# EasyEDA Pro project OLED_UI_WeatherClock.epro

# Schematic Schematic1
Board Name: Board1; Create Date: 2025-10-31
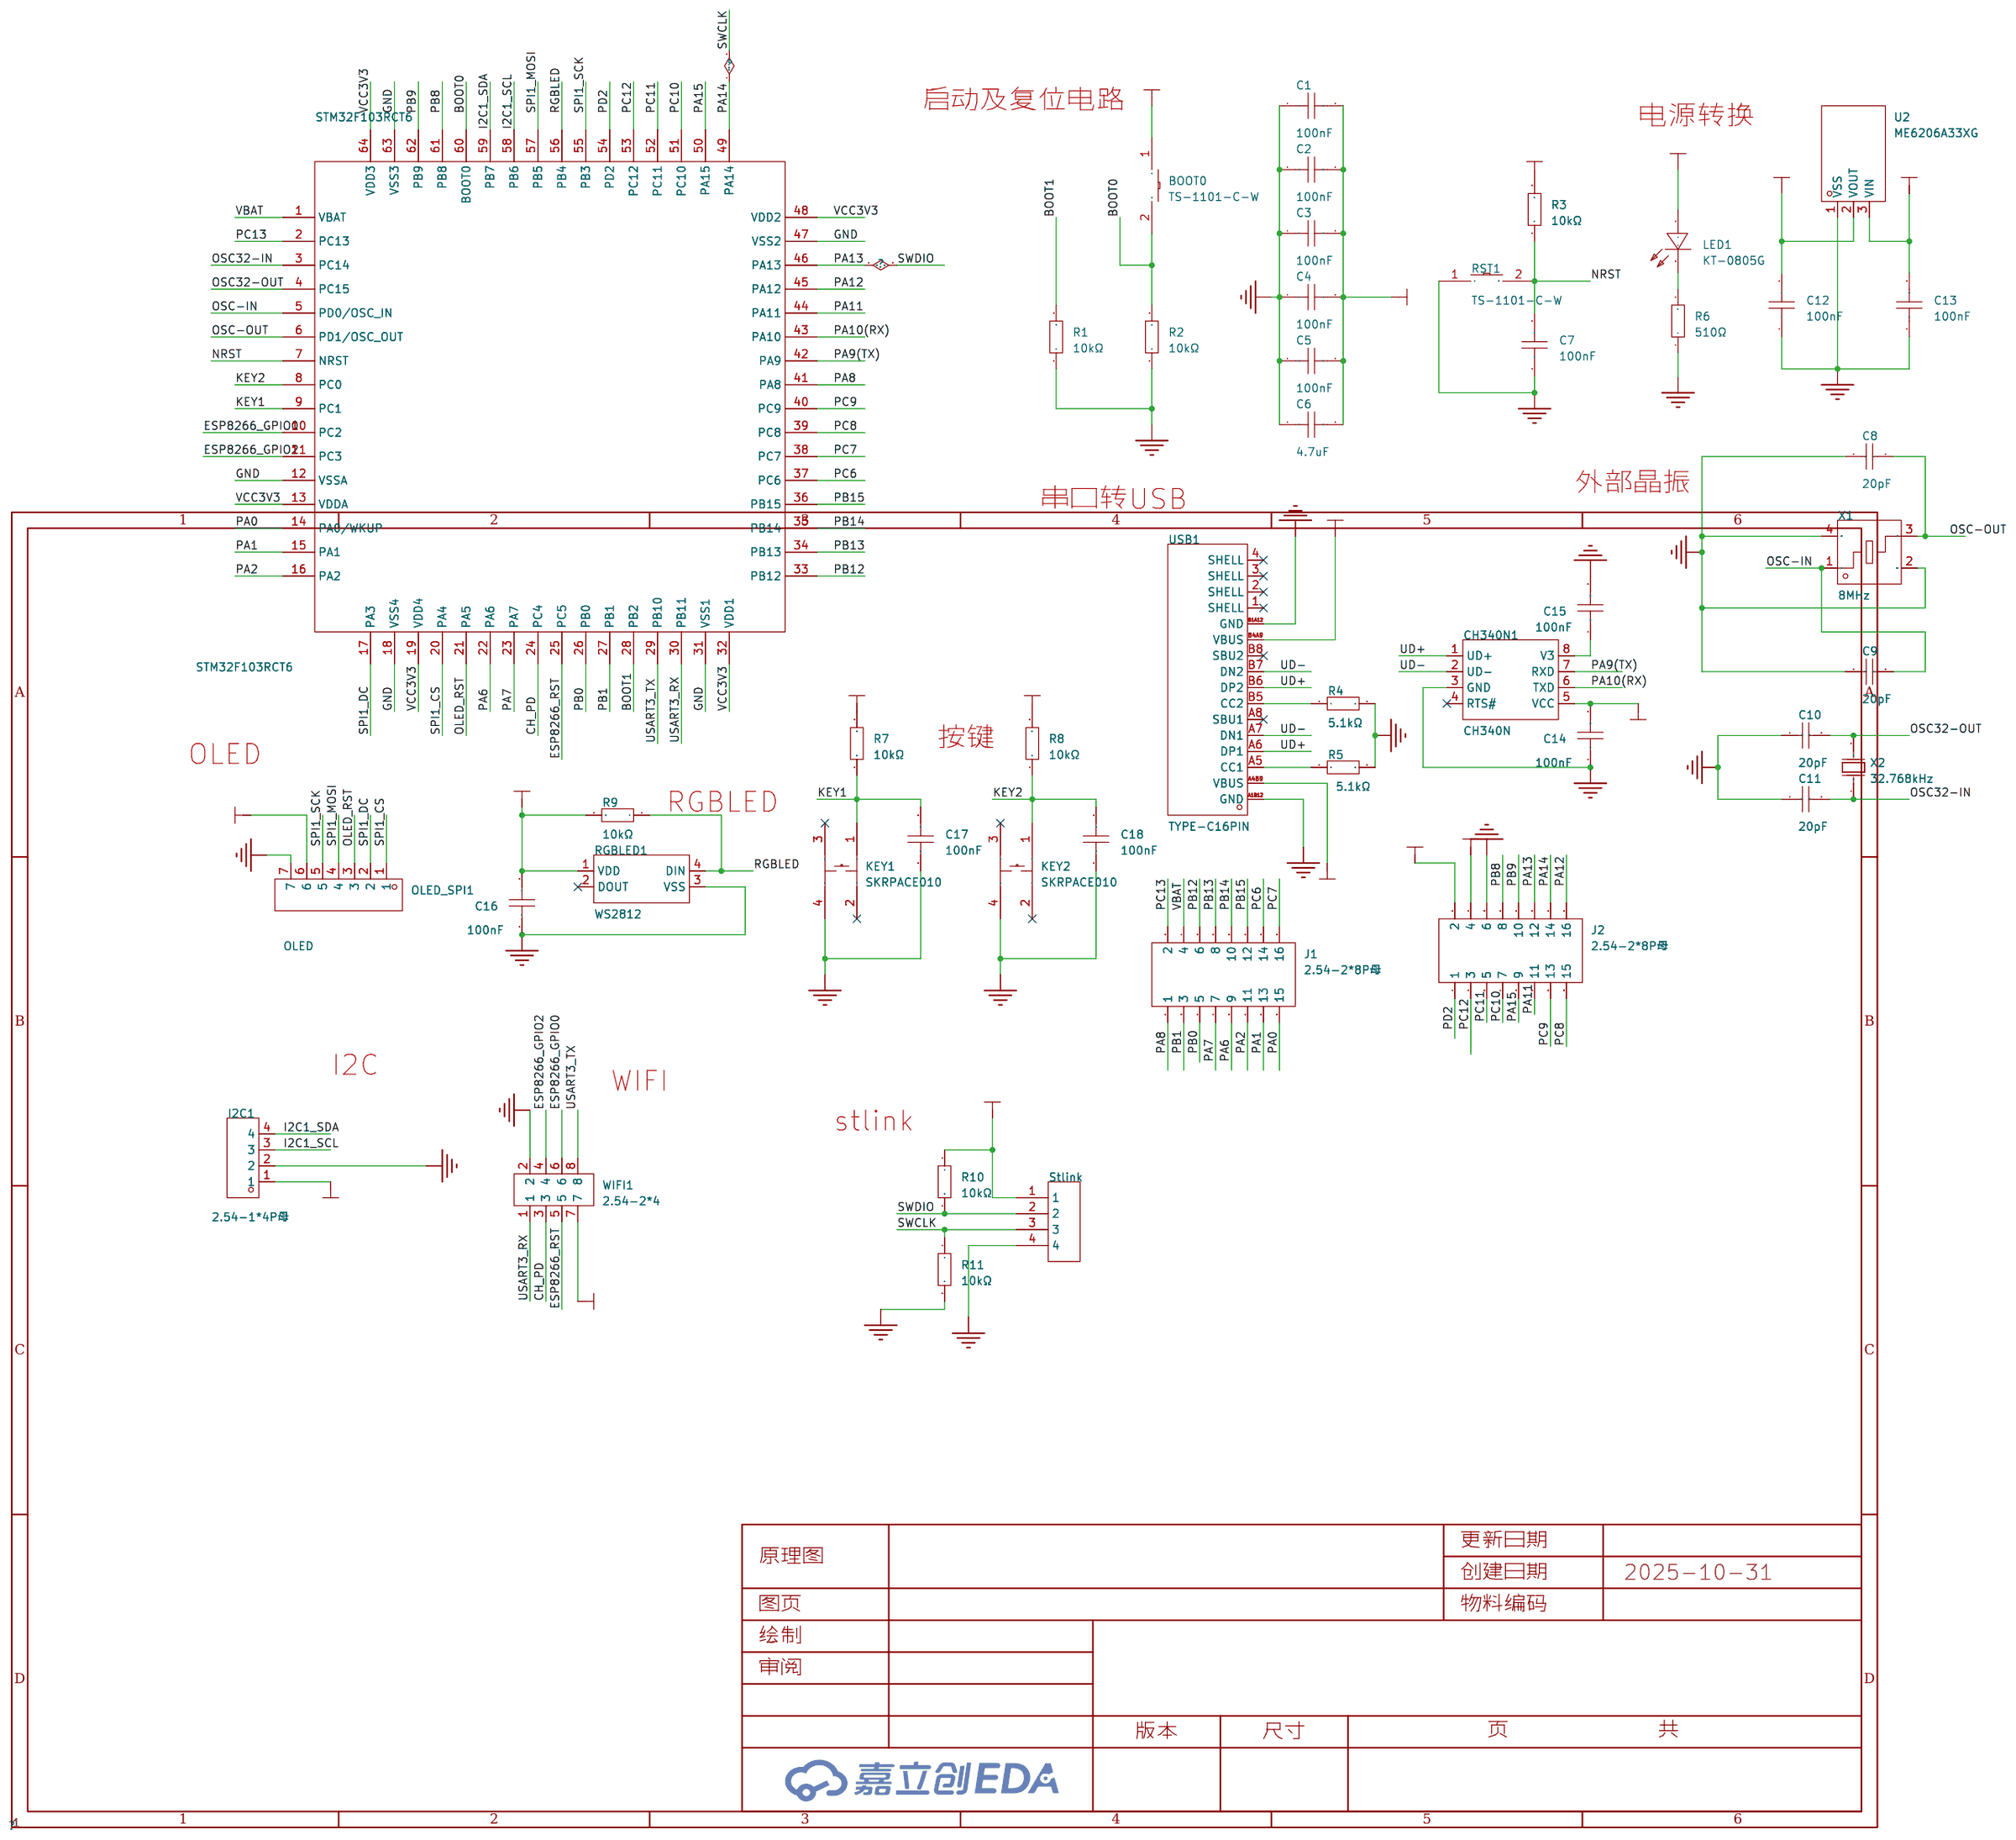
[diagram p0: schematic sheet]

## Parts
BOOT0  TS-1101-C-W  [SW-SMD_L6.0-W3.3-LS8.0]
C1  100nF  [C0603]
C2  100nF  [C0603]
C3  100nF  [C0603]
C4  100nF  [C0603]
C5  100nF  [C0603]
C6  4.7uF  [C0603]
C7  100nF  [C0603]
C8  20pF  [C0603]
C9  20pF  [C0603]
C10  20pF  [C0603]
C11  20pF  [C0603]
C12  100nF  [C0603]
C13  100nF  [C0603]
C14  100nF  [C0603]
C15  100nF  [C0603]
C16  100nF  [C0603]
C17  100nF  [C0603]
C18  100nF  [C0603]
CH340N1  CH340N  [SOP-8_L4.9-W3.9-P1.27-LS6.0-BL]
I2C1  2.54-1*4P母  [HDR-TH_4P-P2.54-V-F]
J1  2.54-2*8P母  [HDR-TH_16P-P2.54-V-F-R2-C8-S2.54]
J2  2.54-2*8P母  [HDR-TH_16P-P2.54-V-F-R2-C8-S2.54]
KEY1  SKRPACE010  [KEY-SMD_4P-L4.2-W3.2-P2.20-LS4.6]
KEY2  SKRPACE010  [KEY-SMD_4P-L4.2-W3.2-P2.20-LS4.6]
LED1  KT-0805G  [LED0805-R-RD]
OLED_SPI1  OLED  [HDR-TH_7P-P2.54-V-F]
R1  10kΩ  [R0603]
R2  10kΩ  [R0603]
R3  10kΩ  [R0603]
R4  5.1kΩ  [R0805]
R5  5.1kΩ  [R0805]
R6  510Ω  [R0603]
R7  10kΩ  [R0603]
R8  10kΩ  [R0603]
R9  10kΩ  [R0603]
R10  10kΩ  [R0603]
R11  10kΩ  [R0603]
RGBLED1  WS2812  [LED-SMD_4P-L5.0-W5.0-TL-A]
RST1  TS-1101-C-W  [SW-SMD_L6.0-W3.3-LS8.0]
Stlink  -  [排针_卧贴_2.54mm_1*4P]
STM32F103RCT6  STM32F103RCT6  [LQFP64]
U2  ME6206A33XG  [SOT-23-3_L2.9-W1.6-P1.90-LS2.8-BR]
USB1  TYPE-C16PIN  [USB-C-SMD_TYPE-C16PIN]
WIFI1  2.54-2*4  [HDR-TH_8P-P2.54-V-F-R2-C4-S2.54]
X1  8MHz  [CRYSTAL-SMD_4P-L3.2-W2.5-BL]
X2  32.768kHz  [CRYSTAL-SMD_L3.2-W1.5-1]

## Library data of the parts
BOOT0 RST1 = TS-1101-C-W: 电路结构:单刀单掷;按钮形状:矩形按钮;作用力:260gf;安装方式:立贴;开关长度:6mm;开关宽度:3.6mm;开关高度:2.5mm;带支架:不带;触点电流:50mA;额定电压(AC):-;额定电压(DC):12V;额定功率:-;绝缘电阻:-;带灯:无;机械寿命:5万次;; LCSC Part Name: 6*3.6*2.5mm 立贴 轻触开关; Supplier Part: C318938; Manufacturer: XKB Connectivity(中国星坤); Supplier Footprint: SMD; JLCPCB Part Class: 扩展库; Datasheet: https://atta.szlcsc.com/upload/public/pdf/source/20200227/C318938_C2E53B1EEDE37D980A33616AC086DE53.pdf; Supplier: LCSC; Circuit: 单刀单掷; Actuator Style: 矩形按钮; Operating Force: 260gf; Mounting Style: 立贴; Switch Length: 6mm; Switch Width: 3.6mm; Switch Height: 2.5mm; Strike Gundam: 不带; Contact Current: 50mA; Voltage Rating (DC): 12V; Actuator/Cap Color: 白色带淡绿; With Lamp: 无; Mechanical Life: 5万次; Operating Temperature: -30℃~+85℃
C1-C5 C7 C12-C18 = CGA0603X7R104K500JT: 容值:100nF;精度:±10%;额定电压:50V;温度系数:X7R;; LCSC Part Name: 100nF ±10% 50V; Supplier Part: C6119867; Manufacturer: HRE(芯声); Supplier Footprint: 0603; JLCPCB Part Class: 扩展库; Datasheet: https://atta.szlcsc.com/upload/public/pdf/source/20250103/C44077DA9E7B3EFAE02F22B6D3D1CBC9.pdf; Supplier: LCSC; Tolerance: ±10%; Voltage Rating: 50V; Temperature Coefficient: X7R
C6 = CL10A475KO8NNNC: 容值:4.7uF;精度:±10%;额定电压:16V;温度系数:X5R;; LCSC Part Name: 4.7uF ±10% 16V; Supplier Part: C19666; Manufacturer: SAMSUNG(三星); Supplier Footprint: 0603; JLCPCB Part Class: 基础库; Datasheet: https://item.szlcsc.com/datasheet/CL10A475KO8NNNC/20375.html; Supplier: LCSC; Tolerance: ±10%; Voltage Rating: 16V; Temperature Coefficient: X5R
C8-C11 = CL10C200JB8NNNC: 容值:20pF;精度:±5%;额定电压:50V;温度系数:C0G;; LCSC Part Name: 20pF ±5% 50V; Supplier Part: C1648; Manufacturer: SAMSUNG(三星); Supplier Footprint: 0603; JLCPCB Part Class: 基础库; Datasheet: https://item.szlcsc.com/datasheet/CL10C200JB8NNNC/2000.html; Supplier: LCSC; Tolerance: ±5%; Voltage Rating: 50V; Temperature Coefficient: C0G
CH340N1 = CH340N: 应用功能:USB转串口;接口协议:USB 2.0;通道数:1;数据速率:2Mbps;; LCSC Part Name: USB2.0芯片CH340; Supplier Part: C2977777; Manufacturer: WCH(南京沁恒); Supplier Footprint: SOP-8; JLCPCB Part Class: 扩展库; Datasheet: https://atta.szlcsc.com/upload/public/pdf/source/20240313/115CDE92081B1D6CB446704AD5D0F5F2.pdf; Supplier: LCSC; Applications Function: USB转串口; Protocol: USB 2.0; Number of Channels: 1; Voltage - Supply: 3.3V；5V; Data Rate: 2Mbps; Operating Temperature: -20℃~+70℃
I2C1 = 2.54-1*4P母: 插孔结构:1x4P;间距:2.54mm;行距:-;圆孔/方孔:方孔;安装方式:直插;排数:单排;总孔位数:4P;额定电流:3A;额定电压:-;插孔方向:顶部;塑高:-;触头材质:青铜;触头镀层:-;工作温度:-40℃~+105℃;; LCSC Part Name: 间距:2.54mm 1x4P 直插; Supplier Part: C2718488; Manufacturer: BOOMELE(博穆精密); Supplier Footprint: 插件,P=2.54mm; JLCPCB Part Class: 扩展库; Datasheet: https://item.szlcsc.com/datasheet/2.54-1*4P%25E6%25AF%258D/2834502.html; Supplier: LCSC; Holes Structure: 1x4P; Pitch: 2.54mm; Circular Hole / Square Hole: 方孔; Mounting Type: 直插; Number of Rows: 单排; Number of Positions: 4P; Current Rating: 3A; Holes Direction: 顶部; Contact Material: 青铜; Operating Temperature: -40℃~+105℃
J1 J2 = 2.54-2*8P母: 插孔结构:2x8P;间距:2.54mm;行距:2.54mm;安装方式:直插;排数:双排;总孔位数:16P;塑高:-;触头材质:黄铜;触头镀层:-;; LCSC Part Name: 间距:2.54mm 2x8P 直插; Supplier Part: C30734; Manufacturer: BOOMELE(博穆精密); Supplier Footprint: 插件,P=2.54mm; JLCPCB Part Class: 扩展库; Datasheet: https://item.szlcsc.com/datasheet/2.54-2*8P%25E6%25AF%258D/31491.html; Supplier: LCSC; Holes Structure: 2x8P; Pitch: 2.54mm; Row Spacing: 2.54mm; Mounting Type: 直插; Number of Rows: 双排; Number of Positions: 16P; Contact Material: 黄铜
KEY1 KEY2 = SKRPACE010: 电路结构:单刀单掷;按钮形状:椭圆形按钮;安装方式:立贴;开关长度:4.2mm;开关宽度:3.2mm;开关高度:2.5mm;触点电流:50mA;额定电压:16V;带灯:-;工作寿命:-;; LCSC Part Name: 4.2*3.2*2.5mm 立贴 轻触开关; Supplier Part: C139797; Manufacturer: ALPSALPINE(阿尔卑斯阿尔派); Supplier Footprint: SMD; JLCPCB Part Class: 扩展库; Datasheet: https://item.szlcsc.com/datasheet/SKRPACE010/151122.html; Supplier: LCSC; Circuit: 单刀单掷; Actuator Style: 椭圆形按钮; Mounting Type: 立贴; Length: 4.2mm; Width: 3.2mm; Switch Height: 2.5mm; Contact Current: 50mA; Voltage Rating: 16V
LED1 = KT-0805G: 灯头类型:-;发光颜色:翠绿色;正向压降(Vf):2.6V~3.1V;功率:100mW;正向电流:5mA;波长:513nm~528nm;二极管配置:-;透镜颜色:-;色温:-;发光强度:430mcd;发光角度:120°;载带方式:-;工作温度:-40℃~+85℃;; LCSC Part Name: 0805 翠绿 高亮; Supplier Part: C2297; Manufacturer: KENTO; Supplier Footprint: 0805; JLCPCB Part Class: 基础库; Datasheet: https://item.szlcsc.com/datasheet/KT-0805G/2670.html; Supplier: LCSC; Illumination Color: 翠绿色; Voltage - Forward(Vf): 2.6V~3.1V; Power(Watts): 100mW; Forward Current: 5mA; Wavelength - Dominant: 513nm~528nm; Peak Wavelength: 525nm; Luminous Intensity: 430mcd; Viewing Angle: 120°; Operating Temperature: -40℃~+85℃
OLED_SPI1 = KH-2.54FH-1X7P-H8.5: 插孔结构:1x7P;间距:2.54mm;行距:-;圆孔/方孔:方孔;安装方式:直插;排数:单排;总孔位数:7P;额定电流:3A;额定电压:-;插孔方向:顶部;塑高:8.5mm;工作温度:-40℃~+105℃;; LCSC Part Name: 间距:2.54mm 1x7P 直插; Supplier Part: C2932672; Manufacturer: kinghelm(金航标); Supplier Footprint: 插件,P=2.54mm; JLCPCB Part Class: 扩展库; Datasheet: https://item.szlcsc.com/datasheet/KH-2.54FH-1X7P-H8.5/3278193.html; Supplier: LCSC; Holes Structure: 1x7P; Pitch: 2.54mm; Circular Hole / Square Hole: 方孔; Mounting Type: 直插; Number of Rows: 单排; Number of Positions: 7P; Current Rating: 3A; Holes Direction: 顶部; Insulation Height: 8.5mm; Operating Temperature: -40℃~+105℃
R1-R3 R7-R11 = 0603WAF1002T5E: 电阻类型:厚膜电阻;阻值:10kΩ;精度:±1%;功率:100mW;工作电压:75V;温度系数:±100ppm/℃;; LCSC Part Name: 厚膜电阻 10kΩ ±1% 100mW; Supplier Part: C25804; Manufacturer: UNI-ROYAL(厚声); Supplier Footprint: 0603; JLCPCB Part Class: 基础库; Datasheet: https://item.szlcsc.com/datasheet/0603WAF1002T5E/26547.html; Supplier: LCSC; Type: 厚膜电阻; Tolerance: ±1%; Power(Watts): 100mW; Voltage-Supply(Max): 75V; Temperature Coefficient: ±100ppm/℃; Operating Temperature: -55℃~+155℃
R4 R5 = 0805W8F5101T5E: 电阻类型:厚膜电阻;阻值:5.1kΩ;精度:±1%;功率:125mW;工作电压:150V;温度系数:±100ppm/℃;; LCSC Part Name: 5.1kΩ ±1% 125mW 厚膜电阻; Supplier Part: C27834; Manufacturer: UNI-ROYAL(厚声); Supplier Footprint: 0805; JLCPCB Part Class: 基础库; Datasheet: https://item.szlcsc.com/datasheet/0805W8F5101T5E/28584.html; Supplier: LCSC; Type: 厚膜电阻; Tolerance: ±1%; Power(Watts): 125mW; Voltage-Supply(Max): 150V; Temperature Coefficient: ±100ppm/℃; Operating Temperature: -55℃~+155℃
R6 = 0603WAF5100T5E: 电阻类型:厚膜电阻;阻值:510Ω;精度:±1%;功率:100mW;工作电压:75V;温度系数:±100ppm/℃;; LCSC Part Name: 510Ω ±1% 100mW 厚膜电阻; Supplier Part: C23193; Manufacturer: UNI-ROYAL(厚声); Supplier Footprint: 0603; JLCPCB Part Class: 基础库; Datasheet: https://item.szlcsc.com/datasheet/0603WAF5100T5E/23920.html; Supplier: LCSC; Type: 厚膜电阻; Tolerance: ±1%; Power(Watts): 100mW; Voltage-Supply(Max): 75V; Temperature Coefficient: ±100ppm/℃; Operating Temperature: -55℃~+155℃
RGBLED1 = WS2812: RGB三色灯珠，5050RGB集成光源内置IC幻彩灯珠单点单控5V，高性价比，12mA; Supplier Part: C42417498; Manufacturer: worldsemi; Supplier Footprint: SMD5050-4P; JLCPCB Part Class: 扩展库; Datasheet: https://atta.szlcsc.com/upload/public/pdf/source/20241220/DE49FA134DE3BC32DD41246C16D24E19.pdf; Supplier: LCSC
Stlink = 排针_卧贴_2.54mm_1*4P
STM32F103RCT6 = STM32F103RCT6: Supplier: LCSC; Manufacturer: STMicroelectronics; image: //image.lceda.cn/szlcsc/C8323.jpg; Supplier Part: C8323; JLCPCB Part Class: Basic
U2 = ME6206A33XG: 输出类型:固定;工作电压:6V;输出电压:3.3V;输出电流:300mA;电源纹波抑制比(PSRR):50dB@(1kHz);输出极性:正极;; LCSC Part Name: 输入6V 输出3.3V 300mA; Supplier Part: C161345; Manufacturer: MICRONE(南京微盟); Supplier Footprint: SOT-23; JLCPCB Part Class: 扩展库; Datasheet: https://item.szlcsc.com/datasheet/ME6206A33XG/172726.html; Supplier: LCSC; Output Type: 固定; Voltage - Supply: 6V; Output Voltage: 3.3V; Output Current: 300mA; Power Supply Rejection Ratio (PSRR): 50dB@(1kHz); Voltage Dropout: 320mV@(200mA); standby current: 6uA; Features: 短路保护；过流保护; Operating Temperature: -25℃~+85℃@(Ta); Output Configuration: 正极; Number of Outputs: 1
USB1 = TYPE-C16PIN: 连接器类型:Type-C;协议标准:USB 3.1;公母:母;安装方式:卧贴;触点数量:16P;端口数量:1;额定电流 - 电源:3A;工作温度:-40℃~+85℃;; LCSC Part Name: Type-C 母 卧贴; Supplier Part: C393939; Manufacturer: SHOU HAN(首韩); Supplier Footprint: SMD; JLCPCB Part Class: 扩展库; Datasheet: https://item.szlcsc.com/datasheet/TYPE-C16PIN/372551.html; Supplier: LCSC; Connector Type: Type-C; Protocol Standard: USB 3.1; Gender: 母; Mounting Type: 卧贴; Number of Contacts: 16P; Number of Ports: 1; Current Rating-Power: 3A; Voltage Rating: 30V; Connect-Disconnect Life: 1万次; Detection color: 黑色; Operating Temperature: -40℃~+85℃
WIFI1 = 2.54-2*4: 插孔结构:2x4P;间距:2.54mm;行距:2.54mm;圆孔/方孔:方孔;安装方式:直插;排数:双排;总孔位数:8P;额定电流:2.5A;额定电压:-;插孔方向:顶部;塑高:8.5mm;工作温度:-40℃~+105℃;; LCSC Part Name: 间距:2.54mm 2x4P 直插; Supplier Part: C2977588; Manufacturer: ZHOURI(洲日); Supplier Footprint: 插件,P=2.54mm; JLCPCB Part Class: 扩展库; Datasheet: https://item.szlcsc.com/datasheet/2.54-2*4/3388940.html; Supplier: LCSC; Holes Structure: 2x4P; Pitch: 2.54mm; Row Spacing: 2.54mm; Circular Hole / Square Hole: 方孔; Mounting Type: 直插; Number of Rows: 双排; Number of Positions: 8P; Current Rating: 2.5A; Holes Direction: 顶部; Insulation Height: 8.5mm; Operating Temperature: -40℃~+105℃
X1 = X32258MSB4SI: 晶振类型:贴片晶振;频率:8MHz;常温频差:±10ppm;负载电容:20pF;频率稳定度:±20ppm;; LCSC Part Name: YSX321SL 8MHZ 4P 3225 20PF ±10PPM -40~85℃ (±20PPM); Supplier Part: C2682774; Manufacturer: YXC(扬兴晶振); Supplier Footprint: SMD3225-4P; JLCPCB Part Class: 扩展库; Datasheet: https://item.szlcsc.com/datasheet/X32258MSB4SI/2777871.html; Supplier: LCSC; Type: 贴片晶振; Normal temperature Frequency Tolerance: ±10ppm; Load Capacitance: 20pF; Frequency Stability: ±20ppm; Equivalent Series Resistance(ESR): 120Ω; Operating Temperature: -40℃~+85℃
X2 = XKXGI-SUA-32.768K: 晶振类型:贴片晶振;频率:32.768kHz;常温频差:±20ppm;负载电容:12.5pF;频率稳定度:±30ppm;; LCSC Part Name: YST310S 32.768KHZ 2P 3215 12.5PF ±20PPM -40~85℃; Supplier Part: C5213671; Manufacturer: YXC(扬兴晶振); Supplier Footprint: SMD3215-2P; JLCPCB Part Class: 扩展库; Datasheet: https://item.szlcsc.com/datasheet/XKXGI-SUA-32.768K/5908943.html; Supplier: LCSC; Type: 贴片晶振; Normal temperature Frequency Tolerance: ±20ppm; Load Capacitance: 12.5pF; Frequency Stability: ±30ppm; Operating Temperature: -40℃~+85℃

## Nets
GND: C1.1 C2.1 C3.1 C4.1 C5.1 C6.1 C7.1 C8.1 C9.1 C10.1 C11.1 C12.1 C13.1 C14.1 C15.2 C16.1 C17.1 C18.1 CH340N1.3(GND) I2C1.2 J2.6 KEY1.4 KEY2.4 OLED_SPI1.7 R1.1 R2.1 R4.2 R5.2 R6.1 R11.2 RGBLED1.3(VSS) RST1.1 Stlink.4 STM32F103RCT6.12(VSSA) STM32F103RCT6.18(VSS4) STM32F103RCT6.31(VSS1) STM32F103RCT6.47(VSS2) STM32F103RCT6.63(VSS3) U2.1(VSS) USB1.A1B12(GND) USB1.B1A12(GND) WIFI1.2 X1.2(GND) X1.4(GND)
VBAT: J1.4 STM32F103RCT6.1(VBAT)
VCC3V3: BOOT0.1 C1.2 C2.2 C3.2 C4.2 C5.2 C6.2 C12.2 I2C1.1 J2.4 LED1.1(A) OLED_SPI1.6 R3.2 R7.2 R8.2 R10.1 Stlink.1 STM32F103RCT6.13(VDDA) STM32F103RCT6.19(VDD4) STM32F103RCT6.32(VDD1) STM32F103RCT6.48(VDD2) STM32F103RCT6.64(VDD3) U2.2(VOUT) WIFI1.7
VCC5V: C13.2 C14.2 C16.2 CH340N1.5(VCC) J2.2 R9.2 RGBLED1.1(VDD) U2.3(VIN) USB1.A4B9(VBUS) USB1.B4A9(VBUS)
BOOT0: BOOT0.2 R2.2 STM32F103RCT6.60(BOOT0)
BOOT1: R1.2 STM32F103RCT6.28(PB2)
CH_PD: STM32F103RCT6.24(PC4) WIFI1.3
ESP8266_GPIO0: STM32F103RCT6.10(PC2) WIFI1.6
ESP8266_GPIO2: STM32F103RCT6.11(PC3) WIFI1.4
ESP8266_RST: STM32F103RCT6.25(PC5) WIFI1.5
I2C1_SCL: I2C1.3 STM32F103RCT6.58(PB6)
I2C1_SDA: I2C1.4 STM32F103RCT6.59(PB7)
KEY1: C17.2 KEY1.1 R7.1 STM32F103RCT6.9(PC1)
KEY2: C18.2 KEY2.1 R8.1 STM32F103RCT6.8(PC0)
NRST: C7.2 R3.1 RST1.2 STM32F103RCT6.7(NRST)
OLED_RST: OLED_SPI1.3 STM32F103RCT6.21(PA5)
OSC32-IN: C11.2 STM32F103RCT6.3(PC14) X2.1(OSC1)
OSC32-OUT: C10.2 STM32F103RCT6.4(PC15) X2.2(OSC2)
OSC-IN: C9.2 STM32F103RCT6.5(PD0/OSC_IN) X1.1
OSC-OUT: C8.2 STM32F103RCT6.6(PD1/OSC_OUT) X1.3
PA0: J1.15 STM32F103RCT6.14(PA0/WKUP)
PA1: J1.13 STM32F103RCT6.15(PA1)
PA2: J1.11 STM32F103RCT6.16(PA2)
PA6: J1.9 STM32F103RCT6.22(PA6)
PA7: J1.7 STM32F103RCT6.23(PA7)
PA8: J1.1 STM32F103RCT6.41(PA8)
PA9(TX): CH340N1.7(RXD) STM32F103RCT6.42(PA9)
PA10(RX): CH340N1.6(TXD) STM32F103RCT6.43(PA10)
PA11: J2.11 STM32F103RCT6.44(PA11)
PA12: J2.16 STM32F103RCT6.45(PA12)
PA13: J2.12 R10.2 Stlink.2 STM32F103RCT6.46(PA13)
PA14: J2.14 R11.1 Stlink.3 STM32F103RCT6.49(PA14)
PA15: J2.9 STM32F103RCT6.50(PA15)
PB0: J1.5 STM32F103RCT6.26(PB0)
PB1: J1.3 STM32F103RCT6.27(PB1)
PB8: J2.8 STM32F103RCT6.61(PB8)
PB9: J2.10 STM32F103RCT6.62(PB9)
PB12: J1.6 STM32F103RCT6.33(PB12)
PB13: J1.8 STM32F103RCT6.34(PB13)
PB14: J1.10 STM32F103RCT6.35(PB14)
PB15: J1.12 STM32F103RCT6.36(PB15)
PC6: J1.14 STM32F103RCT6.37(PC6)
PC7: J1.16 STM32F103RCT6.38(PC7)
PC8: J2.15 STM32F103RCT6.39(PC8)
PC9: J2.13 STM32F103RCT6.40(PC9)
PC10: J2.7 STM32F103RCT6.51(PC10)
PC11: J2.5 STM32F103RCT6.52(PC11)
PC12: J2.3 STM32F103RCT6.53(PC12)
PC13: J1.2 STM32F103RCT6.2(PC13)
PD2: J2.1 STM32F103RCT6.54(PD2)
RGBLED: R9.1 RGBLED1.4(DIN) STM32F103RCT6.56(PB4)
SPI1_CS: OLED_SPI1.1 STM32F103RCT6.20(PA4)
SPI1_DC: OLED_SPI1.2 STM32F103RCT6.17(PA3)
SPI1_MOSI: OLED_SPI1.4 STM32F103RCT6.57(PB5)
SPI1_SCK: OLED_SPI1.5 STM32F103RCT6.55(PB3)
UD+: CH340N1.1(UD+) USB1.A6(DP1) USB1.B6(DP2)
UD-: CH340N1.2(UD-) USB1.A7(DN1) USB1.B7(DN2)
USART3_RX: STM32F103RCT6.30(PB11) WIFI1.1
USART3_TX: STM32F103RCT6.29(PB10) WIFI1.8
$1N2522: C15.1 CH340N1.8(V3)
$1N2545: R4.1 USB1.B5(CC2)
$1N2546: R5.1 USB1.A5(CC1)
$1N2621: LED1.2(K) R6.2

Not connected (* = marked no-connect by the designer): CH340N1 4(RTS#)*; KEY1 2* 3*; KEY2 2* 3*; RGBLED1 2(DOUT)*; USB1 1(SHELL)* 2(SHELL)* 3(SHELL)* 4(SHELL)* A8(SBU1)* B8(SBU2)*

## Notes on the sheet
- 启动及复位电路
- 电源转换
- 外部晶振
- 串口转USB
- 按键
- OLED
- RGBLED
- I2C
- WIFI
- stlink

# Board PCB1
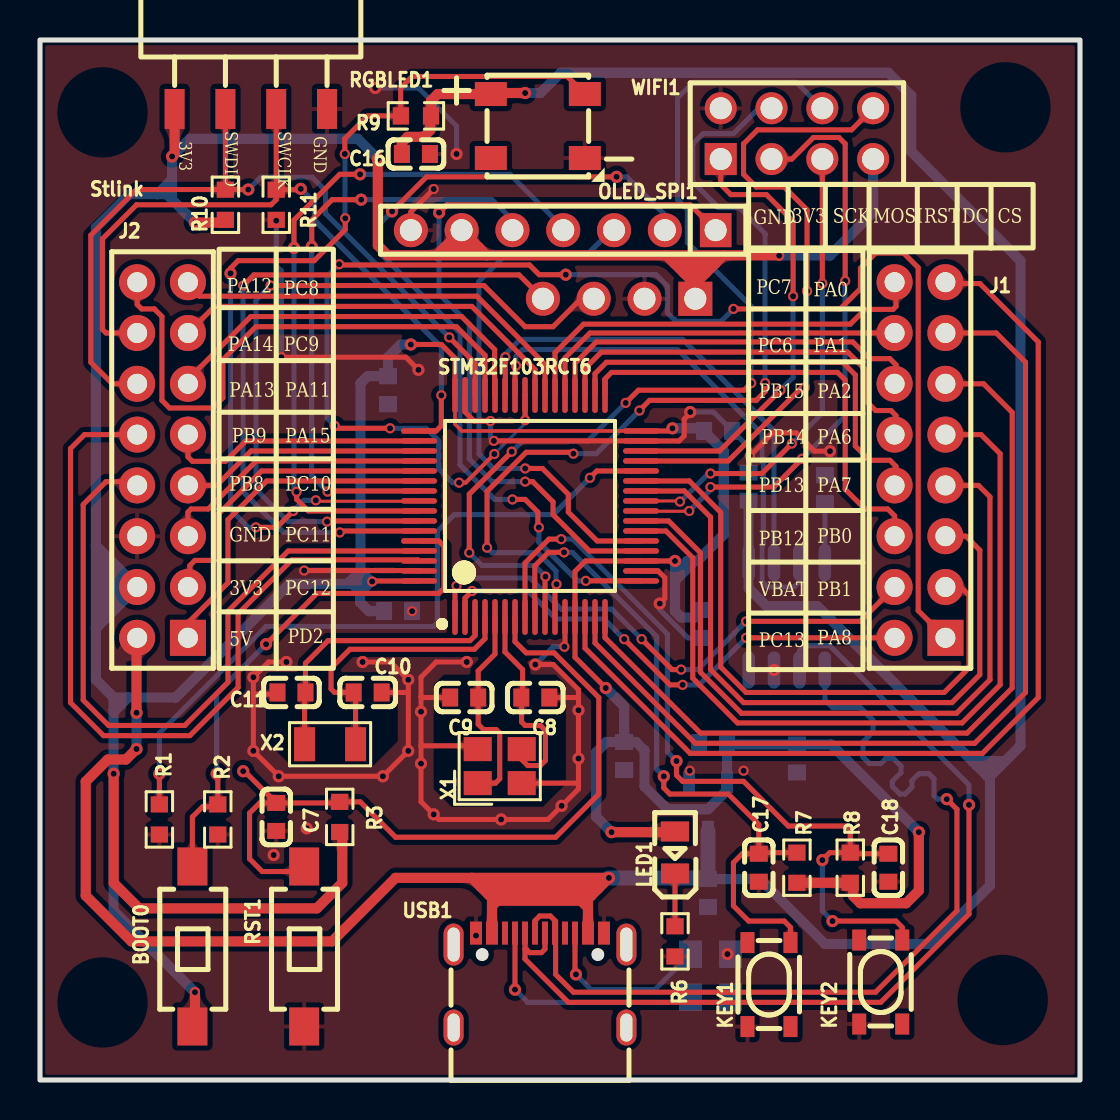
[diagram p1: board, top side]
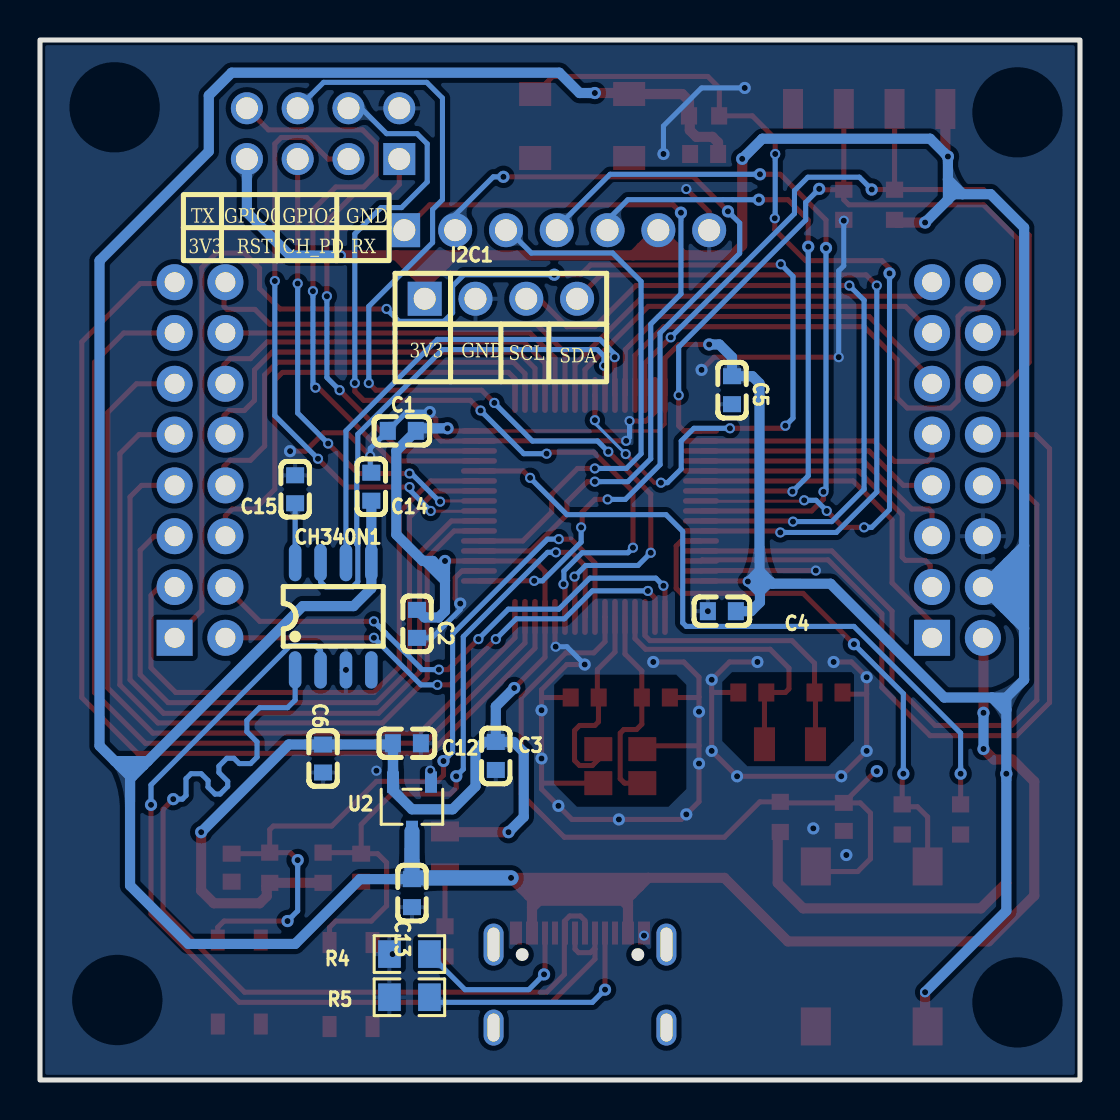
[diagram p2: board, bottom side, seen from below]

Outline 52 x 52 mm; copper layers: Top Layer, Bottom Layer. Coordinates in mm from the lower left corner of the outline.
Outline path: rectangle 0,52 52,0
Stack: Top Layer 0.035mm / Dielectric1 1.51mm FR4 er 4.5 / Bottom Layer 0.035mm

## Design rules (mm)
net OSC-OUT: DP2
net OSC-IN: DP2
net OSC32-OUT: DP1
net OSC32-IN: DP1
net UD+: DP3
net UD-: DP3
template: JLCPCB Capability(Two Layers Board)
spacing copperThickness1oz (default): track to track 0.102, other pairs 0.152 to 0.3
spacing copperThickness2oz: track to track 0.203, other pairs 0.152 to 0.3
track width copperThickness1oz (default): min 0.127, default 0.254, max 2.54
track width copperThickness2oz: min 0.203, default 0.254, max 2.54
differential pair differentialPair (default): width min 0.127, default 0.254, max 2.54; gap min 0.152, default 0.152
via viaSize (default): diameter min 0.5, default 0.61, max 10; hole min 0.3, default 0.305, max 6.3

## Placement (name value [footprint] x y rotation side)
BOOT0  TS-1101-C-W  [SW-SMD_L6.0-W3.3-LS8.0]  7.62 6.68 90 top
C1  100nF  [C0603]  33.91 32.46 180 bottom
C2  100nF  [C0603]  33.15 22.81 90 bottom
C3  100nF  [C0603]  29.21 16.2 90 bottom
C4  100nF  [C0603]  17.91 23.44 180 bottom
C5  100nF  [C0603]  17.4 34.49 90 bottom
C6  4.7uF  [C0603]  37.85 16.08 90 bottom
C7  100nF  [C0603]  11.81 13.15 90 top
C8  20pF  [C0603]  24.76 19.12 180 top
C9  20pF  [C0603]  21.21 19.12 0 top
C10  20pF  [C0603]  16.38 19.38 180 top
C11  20pF  [C0603]  12.57 19.38 0 top
C12  100nF  [C0603]  33.66 16.84 0 bottom
C13  100nF  [C0603]  33.4 9.34 90 bottom
C14  100nF  [C0603]  35.43 29.66 270 bottom
C15  100nF  [C0603]  39.24 29.54 90 bottom
C16  100nF  [C0603]  18.8 46.3 180 top
C17  100nF  [C0603]  35.94 10.61 90 top
C18  100nF  [C0603]  42.42 10.61 90 top
CH340N1  CH340N  [SOP-8_L4.9-W3.9-P1.27-LS6.0-BL]  37.34 23.19 180 bottom
I2C1  2.54-1*4P母  [HDR-TH_4P-P2.54-V-F]  28.96 39.06 180 bottom
J1  2.54-2*8P母  [HDR-TH_16P-P2.54-V-F-R2-C8-S2.54]  44 31 90 top
J2  2.54-2*8P母  [HDR-TH_16P-P2.54-V-F-R2-C8-S2.54]  6.13 31 90 top
KEY1  SKRPACE010  [KEY-SMD_4P-L4.2-W3.2-P2.20-LS4.6]  36.45 4.77 270 top
KEY2  SKRPACE010  [KEY-SMD_4P-L4.2-W3.2-P2.20-LS4.6]  42.04 4.9 270 top
LED1  KT-0805G  [LED0805-R-RD]  31.75 11.38 90 top
OLED_SPI1  OLED  [HDR-TH_7P-P2.54-V-F]  26.16 42.49 180 top
R1  10kΩ  [R0603]  5.97 13.03 90 top
R2  10kΩ  [R0603]  8.89 13.03 90 top
R3  10kΩ  [R0603]  14.99 13.15 270 top
R4  5.1kΩ  [R0805]  33.53 6.3 0 bottom
R5  5.1kΩ  [R0805]  33.53 4.14 0 bottom
R6  510Ω  [R0603]  31.75 6.93 90 top
R7  10kΩ  [R0603]  37.85 10.61 270 top
R8  10kΩ  [R0603]  40.51 10.61 270 top
R9  10kΩ  [R0603]  18.8 48.21 0 top
R10  10kΩ  [R0603]  9.27 43.76 90 top
R11  10kΩ  [R0603]  11.81 43.76 270 top
RGBLED1  WS2812  [LED-SMD_4P-L5.0-W5.0-TL-A]  24.89 47.7 0 top
RST1  TS-1101-C-W  [SW-SMD_L6.0-W3.3-LS8.0]  13.21 6.68 90 top
Stlink  -  [排针_卧贴_2.54mm_1*4P]  10.54 52.65 0 top
STM32F103RCT6  STM32F103RCT6  [LQFP64]  30 28 0 top
U2  ME6206A33XG  [SOT-23-3_L2.9-W1.6-P1.90-LS2.8-BR]  33.4 13.66 90 bottom
USB1  TYPE-C16PIN  [USB-C-SMD_TYPE-C16PIN]  25 4.98 0 top
WIFI1  2.54-2*4  [HDR-TH_8P-P2.54-V-F-R2-C4-S2.54]  37.85 47.32 0 top
X1  8MHz  [CRYSTAL-SMD_4P-L3.2-W2.5-BL]  22.99 15.69 0 top
X2  32.768kHz  [CRYSTAL-SMD_L3.2-W1.5-1]  14.5 16.79 0 top

## Footprints (pads in the part's own frame, mm; a bottom-side part is the same pattern mirrored in y, then rotated)
C0603
  rect 0.8x0.9 smd: 1(-0.7,0) 2(0.7,0)
CRYSTAL-SMD_4P-L3.2-W2.5-BL
  rect 1.4x1.2 smd: 1(-1.1,-0.85) 2(1.1,-0.85) 3(1.1,0.85) 4(-1.1,0.85)
CRYSTAL-SMD_L3.2-W1.5-1
  rect 1.05x1.7 smd: 1(-1.275,0) 2(1.275,0)
HDR-TH_4P-P2.54-V-F
  rect 1.7x1.7 hole 1.1: 1(-3.81,0)
  round 1.7 hole 1.1: 2(-1.27,0) 3(1.27,0) 4(3.81,0)
HDR-TH_7P-P2.54-V-F
  rect 1.575x1.7 hole 1.1: 1(-7.62,0)
  round 1.7 hole 1.1: 2(-5.08,0) 3(-2.54,0) 4(0,0) 5(2.54,0) 6(5.08,0) 7(7.62,0)
HDR-TH_8P-P2.54-V-F-R2-C4-S2.54
  rect 1.6x1.6 hole 1.1: 1(-3.81,-1.27)
  round 1.6 hole 1.1: 2(-3.81,1.27) 3(-1.27,-1.27) 4(-1.27,1.27) 5(1.27,-1.27) 6(1.27,1.27) 7(3.81,-1.27) 8(3.81,1.27)
HDR-TH_16P-P2.54-V-F-R2-C8-S2.54
  rect 1.8x1.8 hole 1: 1(-8.89,-1.27)
  round 1.8 hole 1: 2(-8.89,1.27) 3(-6.35,-1.27) 4(-6.35,1.27) 5(-3.81,-1.27) 6(-3.81,1.27) 7(-1.27,-1.27) 8(-1.27,1.27) 9(1.27,-1.27) 10(1.27,1.27) 11(3.81,-1.27) 12(3.81,1.27) 13(6.35,-1.27) 14(6.35,1.27) 15(8.89,-1.27) 16(8.89,1.27)
KEY-SMD_4P-L4.2-W3.2-P2.20-LS4.6
  rect 1.05x0.7 smd: 1(-2.1,1.075) 2(2.1,1.075) 3(-2.1,-1.075) 4(2.1,-1.075)
LED0805-R-RD
  rect 1x1.399 smd: 1(1.05,0) 2(-1.05,0)
LED-SMD_4P-L5.0-W5.0-TL-A
  rect 1.6x1.2 smd: 1(-2.35,1.6) 2(-2.35,-1.6) 3(2.35,-1.6) 4(2.35,1.6)
LQFP64
  oval 0.28x1.8 smd: 1(-9.249,-4.848) 2(-8.749,-4.848) 3(-8.249,-4.848) 4(-7.749,-4.848) 5(-7.249,-4.848) 6(-6.749,-4.848) 7(-6.249,-4.848) 8(-5.749,-4.848) 9(-5.249,-4.848) 10(-4.749,-4.848) 11(-4.249,-4.848) 12(-3.749,-4.848) 13(-3.249,-4.848) 14(-2.749,-4.848) 15(-2.249,-4.848) 16(-1.749,-4.848) 33(-1.749,6.252) 34(-2.249,6.252) 35(-2.749,6.252) 36(-3.249,6.252) 37(-3.749,6.252) 38(-4.249,6.252) 39(-4.749,6.252) 40(-5.249,6.252) 41(-5.749,6.252) 42(-6.249,6.252) 43(-6.749,6.252) 44(-7.249,6.252) 45(-7.749,6.252) 46(-8.249,6.252) 47(-8.749,6.252) 48(-9.249,6.252)
  oval 1.8x0.28 smd: 17(0.051,-3.048) 18(0.051,-2.548) 19(0.051,-2.048) 20(0.051,-1.548) 21(0.051,-1.048) 22(0.051,-0.548) 23(0.051,-0.048) 24(0.051,0.452) 25(0.051,0.952) 26(0.051,1.452) 27(0.051,1.952) 28(0.051,2.452) 29(0.051,2.952) 30(0.051,3.452) 31(0.051,3.952) 32(0.051,4.452) 49(-11.049,4.452) 50(-11.049,3.952) 51(-11.049,3.452) 52(-11.049,2.952) 53(-11.049,2.452) 54(-11.049,1.952) 55(-11.049,1.452) 56(-11.049,0.952) 57(-11.049,0.452) 58(-11.049,-0.048) 59(-11.049,-0.548) 60(-11.049,-1.048) 61(-11.049,-1.548) 62(-11.049,-2.048) 63(-11.049,-2.548) 64(-11.049,-3.048)
R0603
  rect 0.806x0.864 smd: 1(-0.753,0) 2(0.753,0)
R0805
  rect 1.133x1.377 smd: 1(-1,0) 2(1,0)
SOP-8_L4.9-W3.9-P1.27-LS6.0-BL
  oval 0.63x1.865 smd: 1(-1.905,-2.683) 2(-0.635,-2.683) 3(0.635,-2.683) 4(1.905,-2.683) 5(1.905,2.683) 6(0.635,2.683) 7(-0.635,2.683) 8(-1.905,2.683)
SOT-23-3_L2.9-W1.6-P1.90-LS2.8-BR
  rect 1.07x0.6 smd: 1(1.235,-0.95) 2(1.235,0.95) 3(-1.235,0)
SW-SMD_L6.0-W3.3-LS8.0
  rect 1.9x1.5 smd: 1(-4,0) 2(4,0)
USB-C-SMD_TYPE-C16PIN
  oval 1x2.1 hole 0.6x1.7: 1(-4.32,1.788) 2(4.32,1.788)
  oval 1x1.8 hole 0.6x1.4: 3(-4.32,-2.362) 4(4.32,-2.362)
  rect 0.6x1.15 smd: A1B12(-3.2,2.362) A4B9(-2.4,2.362) B1A12(3.2,2.362) B4A9(2.4,2.362)
  rect 0.3x1.15 smd: A5(-1.25,2.362) A6(-0.25,2.362) A7(0.25,2.362) A8(1.25,2.362) B5(1.75,2.362) B6(0.75,2.362) B7(-0.75,2.362) B8(-1.75,2.362)
排针_卧贴_2.54mm_1*4P
  rect 1x2 smd: 1(-3.81,-4.1) 2(-1.27,-4.1) 3(1.27,-4.1) 4(3.81,-4.1)

## Nets
As in the schematic.

Pads without a net: CH340N1 4; KEY1 2 3; KEY2 2 3; RGBLED1 2; USB1 1 2 3 4 A8 B8

## Via types
v1: diameter 0.61, hole 0.305, Top Layer to Bottom Layer, 64 vias
v2: diameter 0.508, hole 0.305, Top Layer to Bottom Layer, 75 vias

## Routing (per net, layer and track width the routed paths; a pad name or vN(x,y) marks a point on that pad's centre or on a via; arc(x,y) is an arc through that point)
GND: length 119.1
  Top Layer w0.254: v1(18.92,35.51) 18.29,36.14 v2(12.06,36.14) ; 19.05,19.15 19.05,20.14 19.81,20.9 v1(21.34,20.9) ; 19.05,19.15 v1(19.05,18.42) 19.05,16.71 ; 19.05,19.15 19.08,19.12 C9.1 ; OLED_SPI1.7 18.54,43.41 v2(19.69,44.55) ; STM32F103RCT6.12 26.25,21.7 v2(26.22,21.66) ; C8.1 26.9,19.12 26.92,19.15 ; STM32F103RCT6.47 21.25,33.4 21.69,32.96 21.72,32.96 21.74,32.95 v2(22.52,32.95) ; v1(12.32,20.9) 11.43,20.9 v1(10.67,20.14) 10.67,19.29 ; X1.4 21.72,16.71 19.05,16.71 ; v1(30.99,23.82) 31.24,24.08 31.24,25.11 30.9,25.45 STM32F103RCT6.18 ; v1(32.51,33.4) 32.51,33.34 32.21,33.04 32.21,32.21 31.96,31.95 STM32F103RCT6.31 30.05,31.96 v2(22.69,31.96) ; 10.67,19.29 11.79,19.29 11.87,19.38 ; 10.67,19.29 v1(10.67,16.46) v1(11.94,15.19) v1(17.15,15.19) v1(18.41,16.46) 18.41,19.43 ; v2(13.21,25.47) 18.93,25.47 STM32F103RCT6.63 ; 26.92,19.15 v1(26.92,18.49) v1(26.92,16.08) 26.92,14.9 ; 26.92,19.15 26.92,19.51 25.66,20.77 v1(24.76,20.77) ; 26.92,14.9 26.87,14.84 X1.2 ; 26.92,14.9 26.92,14.55 v1(26.08,13.71) 25.4,13.03 v1(23.06,13.03) 19.94,13.03 v1(19.69,13.28) 19.05,13.92 v1(19.05,15.82) 19.05,16.71 ; C10.1 18.36,19.38 18.41,19.43 ; v1(16.13,20.9) 17.53,20.9 v1(18.41,20.01) 18.41,19.43 ; v2(35.49,31.2) 36.64,32.36 37.81,32.36 38.73,31.44 v1(39.5,31.44)
  Bottom Layer w0.254: v1(24.76,20.77) 25.65,21.66 v2(26.22,21.66) ; v2(12.06,36.14) 12.06,40.46 11.81,40.71 v2(11.81,42.97) ; v2(22.69,31.96) 22.52,32.13 v2(22.52,32.95) ; v1(20.83,46.3) 20.83,47.7 18.92,49.6 v1(16.76,49.6) ; v1(32.51,33.4) 33.67,33.4 C1.1 35.49,31.58 v2(35.49,31.2) 35.49,30.42 C14.1 ; v1(30.99,23.82) 30.99,23.52 32.4,22.11 C2.1
  vias: v1(11.68,11.25) v1(13.34,12.58) v1(34.37,6.3) v1(36.7,20.5) v2(18.61,23.44) v2(21.8,7.22) v2(32.49,15.47) v2(35.18,15.47)
VBAT: length 27.3
  Top Layer w0.254: J1.4 41.01,22.93 v2(35.31,22.93) ; v2(30.08,22.04) 31.6,20.52 v2(32.06,20.52) ; v2(20.83,24.71) 20.75,24.63 STM32F103RCT6.1
  Bottom Layer w0.254: v2(30.08,22.04) 28.58,23.54 26.06,23.54 24.51,25.09 21.21,25.09 v2(20.83,24.71) ; v2(32.06,20.52) 32.89,20.52 34.72,22.35 34.72,22.35 35.06,22.69 35.07,22.69 v2(35.31,22.93)
VCC3V3: length 272.5
  Top Layer w0.178: STM32F103RCT6.32 21.09,32.45 20.75,32.79 STM32F103RCT6.48
  Top Layer w0.254: v1(18.54,36.78) 20.07,36.78 20.75,36.09 STM32F103RCT6.48 ; v1(31.75,25.95) STM32F103RCT6.19 27.28,25.95 26.75,25.43 STM32F103RCT6.13 26.75,21.14 v1(28.29,19.6) ; STM32F103RCT6.32 31.49,32.45 v1(31.62,32.58) ; v2(16.61,24.92) 16.64,24.95 STM32F103RCT6.64
  Top Layer w0.508: v1(16.89,46.06) 16.89,41.73 17.38,41.23 19.83,41.23 ; 34.18,41.23 31.31,41.23 ; 34.18,41.23 36.94,41.23 v2(36.96,41.22) ; 34.18,41.23 33.76,40.82 ; 31.31,41.23 31.73,40.82 ; 31.31,41.23 22.34,41.23 ; 21.95,41.63 22.34,41.23 ; 21.95,41.63 OLED_SPI1.6 20.22,41.63 ; 21.95,41.63 20.22,41.63 ; 22.34,41.23 19.83,41.23 ; v1(7.75,42.87) 9.14,42.87 R10.1 ; v2(7.75,4.39) 7.75,2.8 7.62,2.68 ; LED1.1 31.72,12.39 v1(28.57,12.39) ; Stlink.1 6.73,46.3 v1(6.6,46.17) ; R7.2 R8.2 40.66,9.71 40.66,9.19 41.02,8.84 43.31,8.84 43.94,9.47 v1(43.94,12.39) ; 32.19,40.35 31.73,40.82 ; 32.19,40.35 33.3,40.35 ; 32.19,40.35 32.62,39.93 32.62,39.21 I2C1.1 32.89,39.19 32.89,39.95 33.3,40.35 ; 31.73,40.82 33.76,40.82 ; 33.76,40.82 33.3,40.35 ; 19.83,41.23 20.22,41.63 ; v1(3.68,15.31) 3.68,9.85 4.95,8.58 13.84,8.58 15.11,9.85 15.11,12.27 R3.2
  Bottom Layer w0.508: 16.55,24.92 16,24.38 ; 16.55,24.92 v2(16.61,24.92) ; 16.55,24.92 15.5,24.92 ; 16.55,24.92 16.02,25.45 ; 16,24.38 16,24.42 15.5,24.92 ; 16,24.38 16,23.89 16.45,23.44 C4.2 ; 31.75,25.34 31.75,24.96 ; 31.75,25.34 v1(31.75,25.95) ; 31.75,25.34 32.36,25.95 32.74,25.95 ; 31.75,24.96 32.74,25.95 ; 31.75,24.96 31.75,23.44 32.07,23.12 32.77,23.12 33.27,23.63 ; v2(36.96,41.22) 39.5,41.22 41.66,43.38 WIFI1.7 ; v1(16.89,46.06) 15.88,47.06 7.49,47.06 v1(6.6,46.17) 6.6,45.03 ; 3.63,25.88 3.63,23.75 3.79,23.58 ; 3.63,25.88 3.24,26.27 ; 3.63,25.88 4.03,25.48 ; 3.24,26.27 2.79,26.71 ; 3.24,26.27 3.24,23.09 3.27,23.06 ; 2.79,26.71 2.79,22.59 ; 2.79,26.71 2.79,42.62 4.47,44.29 5.86,44.29 ; 5.86,44.29 6.6,45.03 ; 5.86,44.29 6.33,44.29 6.6,44.02 ; 3.68,19.12 4.4,19.12 ; 3.68,19.12 3.68,18.51 ; 3.68,19.12 2.79,20.01 2.79,22.59 ; 4.4,19.12 3.79,18.51 3.68,18.51 ; 4.4,19.12 6.78,19.12 12.47,24.81 15.39,24.81 15.5,24.92 ; 4.03,23.82 3.79,23.58 ; 4.03,23.82 4.03,25.48 ; 4.03,23.82 J2.4 4.03,25.48 ; 3.79,23.58 3.27,23.06 ; 3.68,18.51 v1(3.68,15.31) 3.68,8.45 v2(7.75,4.39) ; 16.02,25.45 15.5,24.92 ; 16.02,25.45 16.02,34.83 16.38,35.19 C5.2 17.4,36.14 18.03,36.78 v1(18.54,36.78) ; v1(31.62,32.58) 33.06,32.58 34.18,31.46 34.18,27.27 32.86,25.95 32.74,25.95 ; v1(28.29,19.6) 29.21,18.68 C3.2 ; C3.2 29.8,16.9 30.23,16.48 30.23,14.68 31.37,13.53 33.4,13.53 34.35,14.48 U2.2 34.35,16.83 C12.2 34.42,16.78 C6.2 39.56,16.78 v1(43.94,12.39) ; C3.2 28.32,16.9 27.81,16.39 27.81,13.15 v1(28.57,12.39) ; 2.79,22.59 3.27,23.06 ; 6.6,45.03 6.6,44.02 ; 6.6,44.02 v1(7.75,42.87)
VCC5V: length 184.1
  Top Layer w0.508: 22.02,9.67 27.82,9.67 27.92,9.58 ; 22.02,9.67 21.59,10.11 ; 22.02,9.67 22.4,9.29 ; 22.4,9.29 22.6,9.09 22.6,8.7 ; 22.4,9.29 27.5,9.29 27.57,9.23 ; v1(4.83,18.36) 4.83,22.08 J2.2 ; v1(24.26,49.35) 22.59,49.35 RGBLED1.1 19.89,49.3 19.55,48.96 R9.2 19.51,48.17 19.51,47.49 19.18,47.16 18.38,47.16 18.1,46.87 C16.2 ; 27.92,9.58 v1(28.45,10.11) 21.59,10.11 ; 27.92,9.58 27.57,9.23 ; 22.6,8.7 22.6,7.22 ; 22.6,8.7 22.86,8.96 27.05,8.96 27.4,8.61 ; 27.4,8.61 27.4,9.06 27.57,9.23 ; 27.4,8.61 27.4,7.22 ; 21.59,10.11 17.78,10.11 14.6,6.93 4.57,6.93 2.29,9.22 2.29,14.92 3.39,16.02 4.3,16.02 v1(4.83,16.55)
  Bottom Layer w0.508: 47.5,15.19 47.5,9.72 44.58,6.8 39.24,6.8 36,10.04 C13.2 ; 47.5,15.19 47.37,15.19 46.83,15.73 ; 47.5,15.19 48.04,15.73 ; 46.83,15.73 46.61,15.95 ; 46.83,15.73 48.04,15.73 ; 46.61,15.95 38.86,23.69 36.32,23.69 35.43,24.58 CH340N1.5 C14.2 ; 46.61,15.95 48.26,15.95 ; v1(24.26,49.35) 25.02,49.35 26.03,50.36 42.42,50.36 43.56,49.22 43.56,46.43 49.02,40.97 49.02,16.71 48.26,15.95 ; 48.04,15.73 48.26,15.95 ; v1(4.83,16.55) v1(4.83,18.36)
  Bottom Layer w0.762: v1(28.45,10.11) 33.34,10.11 C13.2 U2.3
BOOT0: length 26.6
  Top Layer w0.254: v1(8.83,15.31) 8.89,15.26 R2.2 8.77,13.66 8.13,13.66 7.62,13.15 BOOT0.2 ; v1(11.3,21.79) 13.84,24.33 19.94,24.33 20.19,24.58 20.19,26.7 19.94,26.95 STM32F103RCT6.60
  Bottom Layer w0.254: v1(11.3,21.79) 8.83,19.32 v1(8.83,15.31)
BOOT1: length 35.8
  Top Layer w0.254: v2(27.5,30.11) 27.84,30.45 STM32F103RCT6.28 ; R1.2 v1(5.97,15.31)
  Bottom Layer w0.254: v2(27.5,30.11) 25.65,28.27 20.7,28.27 19.86,27.43 19.86,22.86 19.69,22.68 11.3,22.68 5.97,17.34 v1(5.97,15.31)
CH_PD: length 30.1
  Top Layer w0.152: STM32F103RCT6.24 30.07,28.44 32.45,28.44 v2(32.46,28.45)
  Top Layer w0.254: WIFI1.3 37.59,46.05 38.67,47.13 39.94,47.13 40.26,46.81 v2(40.26,39.95) ; v2(33.52,29.65) 36.69,29.65 v2(38.1,31.06)
  Bottom Layer w0.254: v2(32.46,28.45) 33.52,29.51 v2(33.52,29.65) ; v2(40.26,39.95) 40.26,33.22 v2(38.1,31.06)
ESP8266_GPIO0: length 49.5
  Top Layer w0.254: v2(25.27,25.17) 25.25,25.15 STM32F103RCT6.10 ; v2(23.59,31.41) 21.46,29.29 v2(21.46,26.36) ; v2(35.56,34.85) 35.2,34.49 29.92,34.49 v2(29.28,33.86)
  Bottom Layer w0.254: v2(25.27,25.17) 24.72,25.73 22.1,25.73 v2(21.46,26.36) ; v2(29.28,33.86) 27.38,31.95 24.12,31.95 v2(23.59,31.41) ; 39.12,48.59 37.82,49.88 32.66,49.88 31.88,49.09 31.88,44.02 32.37,43.52 32.37,41.87 35.56,38.68 v2(35.56,34.85)
ESP8266_GPIO2: length 44.3
  Top Layer w0.254: v2(36.26,34.85) 36.26,34.43 35.81,33.98 30.48,33.98 v2(29.97,33.47) ; v2(26.67,31.31) 26.6,31.39 24.31,31.39 22.35,29.43 v2(22.35,26.62) ; STM32F103RCT6.11 25.75,24.68 25.83,24.76 v2(25.83,24.79)
  Bottom Layer w0.254: 36.58,48.59 35.94,48.59 34.67,47.32 33.15,47.32 32.64,46.81 32.64,44.9 33.92,43.62 34.95,43.62 36.26,42.31 v2(36.26,34.85) ; v2(29.97,33.47) 27.81,31.31 v2(26.67,31.31) ; v2(22.35,26.62) 22.61,26.36 24.89,26.36 25.81,25.45 25.81,24.81 v2(25.83,24.79)
ESP8266_RST: length 23.6
  Top Layer w0.152: STM32F103RCT6.25 31.96,28.95 v2(32,28.92)
  Top Layer w0.254: WIFI1.5 v2(39.12,39.82) ; v2(37.59,31.82) 36.09,30.32 v2(33.52,30.32)
  Bottom Layer w0.254: v2(37.59,31.82) 39.12,33.35 v2(39.12,39.82) ; v2(33.52,30.32) 33.43,30.32 32.02,28.92 v2(32,28.92)
I2C1_SCL: length 36.9
  Top Layer w0.254: STM32F103RCT6.58 14.38,27.95 v2(14.35,27.92) ; v2(11.53,39.72) 22.2,39.72 24.26,37.67 25.65,37.67 27.05,39.06 I2C1.3
  Bottom Layer w0.254: v2(14.35,27.92) 12.41,27.92 10.79,29.54 10.79,38.98 v2(11.53,39.72)
I2C1_SDA: length 35.7
  Top Layer w0.254: v2(14.99,27.38) 15.06,27.45 STM32F103RCT6.59 ; I2C1.4 23.95,40.25 10.69,40.25 v2(10.16,39.72)
  Bottom Layer w0.254: v2(14.99,27.38) 12.18,27.38 10.16,29.4 v2(10.16,39.72)
KEY1: length 35
  Top Layer w0.254: KEY1.1 37.52,7.63 37.21,7.95 35.43,7.95 34.67,8.71 34.67,10.87 35.12,11.31 C17.2 ; C17.2 35.94,12.77 34.42,14.3 31.5,14.3 31.19,14.6 v1(31.19,15.19) ; C17.2 35.99,11.37 R7.1 ; STM32F103RCT6.9 24.74,23.16 24.74,25.7 25.42,26.38 v2(26.21,26.38)
  Bottom Layer w0.254: v2(26.21,26.38) 26.62,26.38 30.84,22.17 30.84,15.54 v1(31.19,15.19)
KEY2: length 41.5
  Top Layer w0.254: R8.1 40.51,12.52 40.33,12.7 37.41,12.7 35.18,14.93 32.13,14.93 31.82,15.24 v1(31.82,15.95) ; R8.1 39.49,11.37 v1(39.12,11) ; R8.1 40.57,11.31 C18.2 ; v1(39.62,7.95) 42.8,7.95 43.11,7.63 KEY2.1 ; v2(26.06,27.04) 25.45,27.04 24.25,25.85 STM32F103RCT6.8
  Bottom Layer w0.254: v2(26.06,27.04) 26.62,27.04 31.37,22.3 31.37,16.4 v1(31.82,15.95) ; v1(39.12,11) 39.12,8.45 v1(39.62,7.95)
NRST: length 38.4
  Top Layer w0.254: C7.2 10.22,15.44 v1(10.16,15.44) ; C7.2 14.93,13.85 R3.1 16.01,13.91 17.78,12.14 25.78,12.14 27.94,14.3 27.94,19.12 25.71,21.36 24.31,21.36 23.75,21.92 23.75,23.15 STM32F103RCT6.7 ; C7.2 10.99,13.85 10.48,13.34 10.48,11.06 11.11,10.42 12.95,10.42 RST1.2
OLED_RST: length 26.9
  Top Layer w0.254: STM32F103RCT6.21 27.86,26.95 26.42,28.39 26.42,29.28 25.12,30.58 v2(24.26,30.58)
  Bottom Layer w0.254: OLED_SPI1.3 28.57,42.49 27.43,41.35 23.37,41.35 21.95,39.93 21.95,31.31 22.68,30.58 v2(24.26,30.58)
OSC32-IN: length 13.9
  Top Layer w0.254: 13.34,19.31 13.4,19.38 ; 21.75,23.15 21.75,22.22 21.5,21.97 14.4,21.97 13.27,20.84 C11.2 ; X2.1 13.23,19.2
OSC32-OUT: length 14
  Top Layer w0.254: STM32F103RCT6.4 22.25,22.07 21.72,21.54 15.49,21.54 14.55,20.59 14.55,19.56 14.73,19.38 C10.2 ; 15.78,19.16 X2.2
OSC-IN: length 10.4
  Top Layer w0.254: STM32F103RCT6.5 22.75,21.3 21.91,20.46 C9.2 21.91,17.79 22.17,17.52 22.81,17.52 22.99,17.34 22.99,15.06 22.77,14.84 X1.1
OSC-OUT: length 10.5
  Top Layer w0.254: X1.3 24.09,16.02 24.38,15.72 25.02,15.72 25.27,15.98 25.27,17.47 25.02,17.73 24.26,17.73 24.08,17.91 24.08,19.36 24.06,19.38 24.13,19.44 24.13,20.52 23.25,21.4 STM32F103RCT6.6
PA0: length 51.2
  Top Layer w0.254: STM32F103RCT6.14 27.25,21.59 32.51,16.33 47.12,16.33 49.91,19.12 49.91,36.9 46.99,39.82 45.34,39.82 J1.15
PA1: length 47.1
  Top Layer w0.254: J1.13 47.81,37.35 49.28,35.89 49.28,19.38 46.74,16.84 32.77,16.84 27.75,21.85 STM32F103RCT6.15
PA2: length 42
  Top Layer w0.254: J1.11 47.18,34.81 48.61,33.38 48.61,19.6 46.35,17.34 33.02,17.34 28.25,22.11 STM32F103RCT6.16
PA6: length 40.9
  Top Layer w0.254: STM32F103RCT6.22 31.29,27.45 32.64,26.11 32.64,20.09 34.88,17.85 46.1,17.85 48.01,19.76 48.01,31.31 47.05,32.27 J1.9
PA7: length 37.2
  Top Layer w0.254: STM32F103RCT6.23 31.43,27.95 33.02,26.36 33.02,20.39 35.08,18.34 45.82,18.34 47.5,20.01 47.5,29.16 46.92,29.73 J1.7
PA8: length 75
  Top Layer w0.203: v2(20.96,29.87) 21.28,29.87 v2(22.72,31.3)
  Top Layer w0.254: v2(17.5,32.58) 14.86,32.58 v2(14.73,32.71) ; J1.1 43.91,23.47 43.91,40.62 43.18,41.35 41.78,41.35 41.02,40.59 41.02,39.57 40,38.55 v2(34.67,38.55) ; v2(24.26,32.99) 24.26,34.25 STM32F103RCT6.41 ; v2(14.96,40.79) 15,40.75 24.47,40.75 24.96,40.27 v1(26.29,40.27)
  Bottom Layer w0.152: v2(24.26,32.99) 24.26,32.84 v2(22.72,31.3)
  Bottom Layer w0.254: v2(17.5,32.58) 19.3,32.58 19.94,31.95 19.94,30.55 20.63,29.87 v2(20.96,29.87) ; v2(14.73,32.71) 14.35,33.09 14.35,40.18 v2(14.96,40.79) ; v2(34.67,38.55) 34.05,37.93 31.8,37.93 31.37,38.36 31.37,39.7 30.8,40.27 v1(26.29,40.27)
PA9(TX): length 26.6
  Top Layer w0.254: STM32F103RCT6.42 23.75,35.67 v2(23.8,35.72)
  Bottom Layer w0.254: v2(23.8,35.72) 23.8,36.19 24.13,36.52 31.88,36.52 36.11,32.29 36.11,30.93 36.16,30.88 36.16,26.79 36.11,26.73 36.11,24.91 36.36,24.66 37.72,24.66 37.97,24.91 CH340N1.7
PA10(RX): length 24.3
  Top Layer w0.254: v2(23.27,36.14) 23.27,34.27 STM32F103RCT6.43
  Bottom Layer w0.254: CH340N1.6 36.7,32.46 32.13,37.03 24,37.03 23.27,36.29 v2(23.27,36.14)
PA11: length 19.8
  Top Layer w0.254: STM32F103RCT6.44 22.73,34.27 22.73,36.52 21.08,38.17 10.54,38.17 7.4,35.03 J2.11
PA12: length 28.5
  Top Layer w0.254: J2.16 4.86,38.78 5.08,38.55 5.72,38.55 6.1,38.17 6.1,33.98 6.48,33.6 8.64,33.6 9.14,34.11 9.14,36.01 10.79,37.67 20.82,37.67 22.25,36.23 STM32F103RCT6.45
PA13: length 39.7
  Top Layer w0.254: J2.12 3.62,34.81 2.54,35.89 2.54,42.24 4.83,44.52 9.26,44.52 R10.2 ; R10.2 Stlink.2 ; R10.2 9.28,44.52 v1(10.41,44.52) ; STM32F103RCT6.46 21.75,35.84 v2(20.46,37.13)
  Bottom Layer w0.254: v1(10.41,44.52) 11.03,45.14 13.61,45.14 14.28,44.47 14.28,43.32 v2(20.46,37.13)
PA14: length 37.6
  Top Layer w0.254: STM32F103RCT6.49 19.81,32.45 20.07,32.71 v2(20.07,34.24) ; J2.14 3.3,37.35 3.12,37.53 3.12,42.06 4.83,43.76 11.56,43.76 11.81,44.02 R11.1 ; v1(13.04,44.56) 13,44.51 R11.1 ; R11.1 Stlink.3
  Bottom Layer w0.254: v2(20.07,34.24) 20.07,36.65 13.72,43 13.72,43.88 v1(13.04,44.56)
PA15: length 13.2
  Top Layer w0.254: STM32F103RCT6.50 10.29,31.95 9.27,30.93 7.62,30.93 7.4,31.16 J2.9
PB0: length 34.6
  Top Layer w0.254: J1.5 46.29,27.19 46.99,26.49 46.99,20.27 45.59,18.87 35.18,18.87 33.53,20.52 33.53,28.14 32.22,29.45 STM32F103RCT6.26
PB1: length 30.8
  Top Layer w0.254: STM32F103RCT6.27 32.47,29.95 34.04,28.38 34.04,20.65 35.31,19.38 45.21,19.38 46.45,20.61 46.45,24.24 46.03,24.65 J1.3
PB8: length 36
  Top Layer w0.254: J2.8 4.67,29.92 3.3,29.92 2.16,28.78 2.16,19 3.43,17.73 7.24,17.73 9.4,19.89 9.4,23.44 12.41,26.45 STM32F103RCT6.61
PB9: length 40.3
  Top Layer w0.254: J2.10 2.22,32.27 1.52,31.57 1.52,18.87 3.17,17.22 7.49,17.22 9.91,19.63 9.91,23.31 12.6,26.01 18.9,26.01 STM32F103RCT6.62
PB12: length 22.6
  Top Layer w0.254: STM32F103RCT6.33 28.25,35.06 28.57,35.38 39.88,35.38 40.26,35 40.26,29.54 41.25,28.55 42.39,28.55 42.73,28.21 J1.6
PB13: length 21.6
  Top Layer w0.254: STM32F103RCT6.34 27.75,35.32 28.32,35.89 40.13,35.89 40.77,35.25 40.77,31.7 41.48,30.99 42.49,30.99 42.8,30.68 42.8,29.8 J1.8
PB14: length 20.4
  Top Layer w0.254: STM32F103RCT6.35 27.25,35.58 28.07,36.39 40.39,36.39 41.28,35.51 41.28,33.98 41.78,33.47 42.54,33.47 42.8,33.22 42.8,32.34 J1.10
PB15: length 19.5
  Top Layer w0.254: J1.12 42.8,34.88 42.8,35.76 42.49,36.07 41.48,36.07 40.64,36.9 27.81,36.9 26.75,35.84 STM32F103RCT6.36
PC6: length 18.8
  Top Layer w0.254: J1.14 27.5,37.35 26.25,36.1 STM32F103RCT6.37
PC7: length 21.4
  Top Layer w0.254: STM32F103RCT6.38 25.75,36.36 27.18,37.79 40.51,37.79 41.25,38.53 42.65,38.53 42.8,38.68 42.8,39.82 J1.16
PC8: length 21.2
  Top Layer w0.254: STM32F103RCT6.39 25.25,35.78 21.84,39.19 7.97,39.19 7.27,39.89
PC9: length 20.5
  Top Layer w0.254: STM32F103RCT6.40 24.75,35.52 21.59,38.68 8.73,38.68 J2.13
PC10: length 12.3
  Top Layer w0.254: STM32F103RCT6.51 10.55,31.45 8.83,29.73 J2.7
PC11: length 13.8
  Top Layer w0.254: STM32F103RCT6.52 10.81,30.95 8.41,28.55 7.55,28.55 7.4,28.39 J2.5
PC12: length 15.8
  Top Layer w0.254: J2.3 7.49,24.75 7.49,25.73 7.75,25.98 8.73,25.98 8.89,26.14 8.89,28.27 11.07,30.45 STM32F103RCT6.53
PC13: length 25.5
  Top Layer w0.254: J1.2 v2(35.31,22.11) ; v2(21.61,24.45) 21.25,24.1 STM32F103RCT6.2 ; v2(32.13,19.76) 31.5,19.76 v2(29.21,22.04)
  Bottom Layer w0.254: v2(32.13,19.76) 32.95,19.76 v2(35.31,22.11) ; v2(21.61,24.45) 21.61,24.46 24.38,24.46 25.78,23.06 28.19,23.06 v2(29.21,22.04)
PD2: length 17.1
  Top Layer w0.254: J2.1 7.4,22.86 9.4,24.86 9.4,28.01 11.34,29.95 STM32F103RCT6.54
RGBLED: length 48
  Top Layer w0.152: v2(13.79,28.98) 13.84,28.94 18.94,28.94 STM32F103RCT6.56
  Top Layer w0.254: RGBLED1.4 26.36,50.18 18.61,50.18 18.03,49.6 18.03,48.21 R9.1 16.38,48.21 15.24,47.06 v2(15.24,46.3) ; v2(12.66,28.45) 11.84,27.63 v2(10.79,27.63) ; v2(15.26,43.09) 15.26,42.52 13.71,40.97 9.91,40.97 9.53,40.59 v1(9.53,40.33)
  Bottom Layer w0.254: v2(15.24,46.3) 15.24,43.11 v2(15.26,43.09) ; v2(12.66,28.45) 13.19,28.98 v2(13.79,28.98) ; v1(9.53,40.33) 9.53,28.52 10.41,27.63 v2(10.79,27.63)
SPI1_CS: length 38.3
  Top Layer w0.254: STM32F103RCT6.20 27.47,26.45 25.65,28.27 25.65,28.9 24.64,29.92 v2(24.26,29.92) ; OLED_SPI1.1 32.51,43.76 20.35,43.76 v1(19.95,43.37)
  Bottom Layer w0.254: v2(24.26,29.92) 22.61,29.92 21.46,31.06 21.46,37.79 19.95,39.3 v1(19.95,43.37) 19.94,43.38
SPI1_DC: length 42.8
  Top Layer w0.254: STM32F103RCT6.17 30.04,24.96 v2(27.29,24.96) ; v2(24.94,27.63) 24.89,27.68 24.89,28.39 24.26,29.03 v2(23.62,29.03) ; v1(28.83,45.16) 19.33,45.16 v1(17.6,43.43)
  Bottom Layer w0.254: v1(17.6,43.43) 17.02,42.85 17.02,41.33 21,37.35 21,30.77 22.73,29.03 v2(23.62,29.03) ; OLED_SPI1.2 31.24,43.25 29.34,45.16 v1(28.83,45.16) ; v2(27.29,24.96) 26.88,24.96 24.94,26.89 v2(24.94,27.63)
SPI1_MOSI: length 36
  Top Layer w0.254: v2(12.83,29.41) 12.83,29.04 13.42,28.45 STM32F103RCT6.57 ; v1(12.7,41.6) 12.7,43 14.99,45.28 v1(16,45.28)
  Bottom Layer w0.254: v1(12.7,41.6) 12.7,29.54 v2(12.83,29.41) ; OLED_SPI1.4 26.16,42.62 23.5,45.28 v1(16,45.28)
SPI1_SCK: length 30
  Top Layer w0.254: v1(13.59,41.67) 13.59,43 14.6,44.02 v1(16.06,44.02) ; STM32F103RCT6.55 14.41,29.45 v2(14.38,29.42)
  Bottom Layer w0.254: v2(14.38,29.42) 13.59,30.21 v1(13.59,41.67) ; v1(16.06,44.02) 17.36,44.02 22.61,44.02 23.75,42.87 23.75,42.62 OLED_SPI1.5
UD+: length 47
  Top Layer w0.254: 24.75,7.22 24.75,7.97 24.99,8.2 25.51,8.2 25.78,7.94 25.78,5.28 26.67,4.39 41.77,4.39 45.85,8.46 45.85,13.53 v1(45.34,14.04)
  Bottom Layer w0.254: v1(45.34,14.04) 44.88,14.04 44.7,14.22 44.7,15.06 44.45,15.31 43.94,15.31 43.6,14.97 43.6,14.64 43.25,14.3 43,14.3 42.62,14.68 42.62,14.93 43.05,15.37 43.05,15.69 42.66,16.09 42.3,16.09 42.04,15.82 41.47,15.82 41.15,16.14 41.15,16.91 41.66,17.42 41.66,17.98 41.02,18.61 39.62,18.61 39.24,19 CH340N1.1
UD-: length 47.1
  Top Layer w0.254: 24.25,6.54 24.28,6.57 24.48,6.37 25.07,6.37 25.25,6.55 USB1.A7 ; 24.25,6.54 24.25,6.05 26.42,3.88 42.04,3.88 46.45,8.3 v1(46.45,13.76) ; 24.25,6.54 USB1.B7
  Bottom Layer w0.254: v1(46.45,13.76) 46.45,14.76 39.49,21.72 38.23,21.72 37.97,21.46 CH340N1.2
USART3_RX: length 22.6
  Top Layer w0.254: WIFI1.1 34.04,44.78 34.54,44.27 36.32,44.27 37.66,42.94 v2(37.66,39.19) ; v2(37.02,34.49) 33.98,31.45 STM32F103RCT6.30
  Bottom Layer w0.254: v2(37.02,34.49) 37.66,35.12 v2(37.66,39.19)
USART3_TX: length 31.3
  Top Layer w0.254: 41.66,48.59 40.58,47.51 35.88,47.51 35.18,46.81 35.18,45.28 35.81,44.65 37.21,44.65 38.35,43.51 v2(38.35,39.44) ; STM32F103RCT6.29 34.41,30.95 38.08,34.62 v2(38.23,34.62)
  Bottom Layer w0.254: v2(38.35,39.44) 38.35,34.74 v2(38.23,34.62)
$1N2522: length 3
  Bottom Layer w0.254: C15.1 CH340N1.8
$1N2545: length 8.9
  Top Layer w0.254: USB1.B5 26.75,5.33 v1(26.8,5.28)
  Bottom Layer w0.254: v1(26.8,5.28) 27.56,4.52 30.75,4.52 R4.1
$1N2546: length 12
  Top Layer w0.254: v1(23.75,4.52) 23.75,7.35
  Bottom Layer w0.254: R5.1 32.27,3.88 24.38,3.88 v1(23.75,4.52)
$1N2621: length 2.6
  Top Layer w0.254: LED1.2 R6.2

## Copper pours and planes (outline as drawn; the poured copper is in the pictures)
GND on Top Layer: 0,52 52,52 52,0 0,0
GND on Bottom Layer: 0,52 52,52 52,0 0,0

Small or netless copper shapes (teardrops, artwork), in the pictures only: 242 on Top Layer, 147 on Bottom Layer

## Text on the board
Bottom Silkscreen Layer: SDA | SCL | GND | 3V3 | RX | GPIO2 | CH_PD | RST | GPIO0 | TX
Top Silkscreen Layer: 3V3 | SWDIO | SWCLK | GND | PA12 | PA14 | PA13 | PB8 | 5V | PB9 | PC8 | PC9 | PA11 | PA15 | PC10 | PC11 | PC12 | PD2 | PC7 | PC6 | PB15 | PB13 | PB12 | VBAT | PC13 | PB14 | PA0 | PA1 | PA2 | PA6 | PA7 | PB0 | PB1 | PA8 | SCK | MOSI | RST | DC | CS
